# EAGLE design MLX90614-IR_V1.0 (EAGLE 9.6.2)
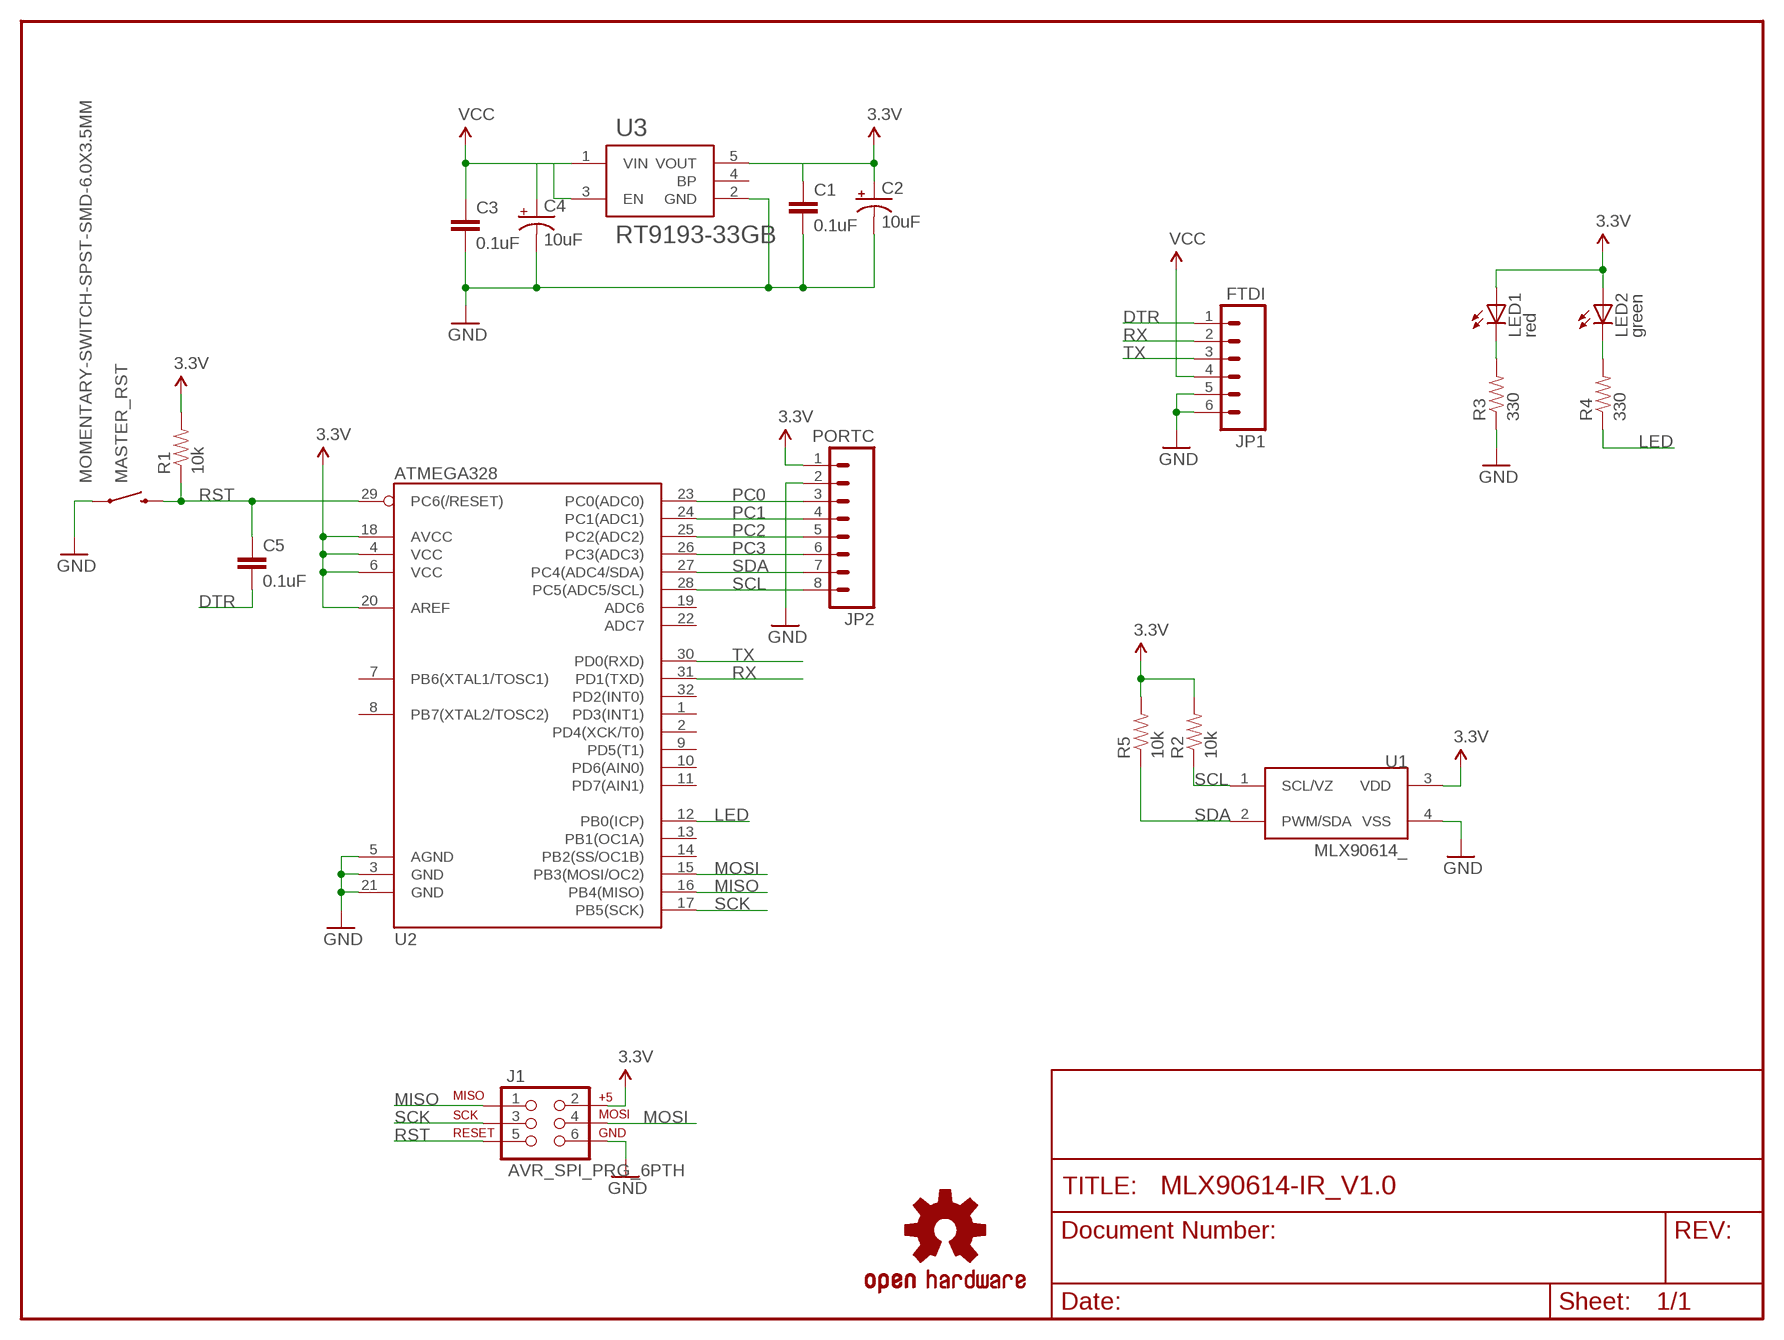
[diagram p0: schematic, sheet 1]

## Parts
C1  0.1uF  CAP0603-CAP  [0603-CAP]
C2  10uF  CAP_POL1206  [EIA3216]
C3  0.1uF  CAP0603-CAP  [0603-CAP]
C4  10uF  CAP_POL1206  [EIA3216]
C5  0.1uF  CAP0603-CAP  [0603-CAP]
J1  AVR_SPI_PRG_6PTH  [2X3]
JP1  FTDI  M06SIP  [1X06]
JP2  PORTC  M08  [1X08]
LED1  red  LED0603  [LED-0603]
LED2  green  LED0603  [LED-0603]
MASTER_RST  MOMENTARY-SWITCH-SPST-SMD-6.0X3.5MM  [TACTILE_SWITCH_SMD_6.0X3.5MM]
R1  10k  RESISTOR0603-RES  [0603-RES]
R2  10k  RESISTOR0603-RES  [0603-RES]
R3  330  RESISTOR0603-RES  [0603-RES]
R4  330  RESISTOR0603-RES  [0603-RES]
R5  10k  RESISTOR0603-RES  [0603-RES]
U1  MLX90614_  [TO-39]
U2  ATMEGA328  ATMEGA168  [TQFP32-08]
U3  RT9193-33GB  [SOT94P279X129-5N]
U$1  OSHW-LOGOS  [OSHW-LOGO-S]

## Nets
3.3V: C1.1 C2.A(+) J1.2 JP2.1 LED1.A LED2.A R1.2 R2.2 R5.2 U1.3(VDD) U2.4(VCC) U2.6(VCC) U2.18(AVCC) U2.20(AREF) U3.5(VOUT)
DTR: C5.2 JP1.1
GND: C1.2 C2.C(-) C3.2 C4.C(-) J1.6 JP1.5 JP1.6 JP2.2 MASTER_RST.1 R3.1 U1.4(VSS) U2.3(GND) U2.5(AGND) U2.21(GND) U3.2(GND)
LED: R4.1 U2.12(PB0(ICP))
MISO: J1.1 U2.16(PB4(MISO))
MOSI: J1.4 U2.15(PB3(MOSI/OC2))
N$2: LED1.C R3.2
N$3: LED2.C R4.2
PC0: JP2.3 U2.23(PC0(ADC0))
PC1: JP2.4 U2.24(PC1(ADC1))
PC2: JP2.5 U2.25(PC2(ADC2))
PC3: JP2.6 U2.26(PC3(ADC3))
RST: C5.1 J1.5 MASTER_RST.2 R1.1 U2.29(PC6(/RESET))
RX: JP1.2 U2.31(PD1(TXD))
SCK: J1.3 U2.17(PB5(SCK))
SCL: JP2.8 R2.1 U1.1(SCL/VZ) U2.28(PC5(ADC5/SCL))
SDA: JP2.7 R5.1 U1.2(PWM/SDA) U2.27(PC4(ADC4/SDA))
TX: JP1.3 U2.30(PD0(RXD))
VCC: C3.1 C4.A(+) JP1.4 U3.1(VIN) U3.3(EN)
Unconnected: U2.1(PD3(INT1)) U2.2(PD4(XCK/T0)) U2.7(PB6(XTAL1/TOSC1)) U2.8(PB7(XTAL2/TOSC2)) U2.9(PD5(T1)) U2.10(PD6(AIN0)) U2.11(PD7(AIN1)) U2.13(PB1(OC1A)) U2.14(PB2(SS/OC1B)) U2.19(ADC6) U2.22(ADC7) U2.32(PD2(INT0)) U3.4(BP)

## Library data of the parts
C1 C3 C5 = SparkFun:CAP: Capacitor Standard 0603 ceramic capacitor, and 0.1" leaded capacitor.
C2 C4 = SparkFun:CAP_POL: Capacitor Polarized These are standard SMD and PTH capacitors. Normally 10uF, 47uF, and 100uF in electrolytic and tantalum varieties. Always verify the external diameter of the through hole cap, it varies with capacity, voltage, and manufacturer. The EIA devices should be standard.
J1 = SparkFun:AVR_SPI_PRG_6: AVR ISP 6 Pin This is the reduced ISP connector for AVR programming. Common on Arduino. This footprint will take up less PCB space and can be used with a 10-pin to 6-pin adapter such as SKU: BOB-08508
JP1 = SparkFun:M06: Header 6 Standard 6-pin 0.1" header. Use with straight break away headers (SKU : PRT-00116), right angle break away headers (PRT-00553), swiss pins (PRT-00743), machine pins (PRT-00117), and female headers (PRT-00115). Molex polarized connector foot print use with SKU : PRT-08094 with associated crimp pins and housings. NOTES ON THE VARIANTS LOCK and LOCK_LONGPADS... This footprint was designed to help hold the alignment of a through-hole component (i.e. 6-pin header) while soldering it into place. You may notice that each hole has been shifted either up or down by 0.005 of an inch from it's more standard position (which is a perfectly straight line). This slight alteration caused the pins (the squares in the middle) to touch the edges of the holes. Because they are alternating, it causes a "brace" to hold the component in place. 0.005 has proven to be the perfect amount of "off-center" position when using our standard breakaway headers. Although looks a little odd when you look at the bare footprint, once you have a header in there, the alteration is very hard to notice. Also, if you push a header all the way into place, it is covered up entirely on the bottom side. This idea of altering the position of holes to aid alignment will be further integrated into the Sparkfun Library for other footprints. It can help hold any component with 3 or more connection pins.
JP2 = SparkFun:M08: Header 8 Standard 8-pin 0.1" header. Use with straight break away headers (SKU : PRT-00116), right angle break away headers (PRT-00553), swiss pins (PRT-00743), machine pins (PRT-00117), and female headers (PRT-00115).
LED1 LED2 = SparkFun:LED: LEDs Standard schematic elements and footprints for 5mm, 3mm, 1206, and 0603 sized LEDs. 5mm - Spark Fun Electronics SKU : COM-00529 (and others)
MASTER_RST = SparkFun-Switches:MOMENTARY-SWITCH-SPST: Momentary Switch (Pushbutton) - SPST Normally-open (NO) SPST momentary switches (buttons, pushbuttons). Variants PTH-12MM - 12mm square, through-hole Momentary Pushbutton Switch - 12mm Square <https://www.sparkfun.com/products/9190> (COM-09190) PTH-6.0MM, PTH-6.0MM-KIT - 6.0mm square, through-hole Mini Pushbutton Switch <https://www.sparkfun.com/products/97> (COM-00097) KIT package intended for soldering kit's - only one side of pads' copper is exposed. PTH-RIGHT-ANGLE-KIT - Right-angle, through-hole Right Angle Tactile Button <https://www.sparkfun.com/products/10791> - Used on SparkFun BigTime Watch Kit <https://www.sparkfun.com/products/11734> SMD-12MM - 12mm square, surface-mount Tactile Button - SMD (12mm) <https://www.sparkfun.com/products/12993> (COM-12993) Used on SparkFun PicoBoard <https://www.sparkfun.com/products/11888> SMD-4.5MM - 4.5mm Square Trackball Switch Used on SparkFun Blackberry Trackballer Breakout <https://www.sparkfun.com/products/13169> SMD-4.6MMX2.8MM - 4.60mm x 2.80mm, surface mount Used on SparkFun SAMD21 Mini Breakout <https://www.sparkfun.com/products/13664> SMD-5.2MM, SMD-5.2-REDUNDANT - 5.2mm square, surface-mount Mini Pushbutton Switch - SMD <https://www.sparkfun.com/products/8720> (COM-08720) Used on Arduino Pro Mini <https://www.sparkfun.com/products/11114> REDUNDANT package connects both switch circuits together SMD-6.0X3.5MM - 6.0 x 3.5mm, surface mount Momentary Reset Switch SMD <https://www.sparkfun.com/products/8229> (COM-08229) SMD-6.2MM-TALL - 6.2mm square, surface mount Tactile Button - SMD (6mm) <https://www.sparkfun.com/products/12992> Used on SparkFun Digital Sandbox <https://www.sparkfun.com/products/12651> SMD-RIGHT-ANGLE - Right-angle, surface mount Used on SparkFun Block for Intel® Edison - Arduino <https://www.sparkfun.com/products/13036>; OC_FARNELL: unknown; PROD_ID: SWCH-00815; SF_SKU: COM-08229
R1-R5 = SparkFun:RESISTOR: Resistor Basic schematic elements and footprints for 0603, 1206, and PTH 1/10th watt (small) resistors.
U1 = SparkFun:MLX90614: Melexis IR Thermometer
U2 = SparkFun:ATMEGA168
U3 = RT9193-33GB:RT9193-33GB: RT9193 Series 300 mA 3.3 V Ultra-Low Noise Ultra-Fast CMOS LDO Regulator-SC-70-5 Buy Part <https://snapeda.com/parts/RT9193-33GB/Richtek%20USA/view-part/?ref=eda>; AVAILABILITY: Warning; DESCRIPTION: Linear Voltage Regulator IC 1 Output 300mA SOT-23-5; DIGIKEY-PURCHASE-URL: https://snapeda.com/shop?store=DigiKey&id=55570; MF: Richtek USA; MP: RT9193-33GB; PACKAGE: SOT-23-5 Richtek; PRICE: None
U$1 = SparkFun:OSHW-LOGO: Open Source Hardware Logo This logo indicates the piece of hardware it is found on incorporates a OSHW license and/or adheres to the definition of open source hardware found here: http://freedomdefined.org/OSHW

## Net classes
0 default: width 0.254 mm, drill 0.584 mm, clearance 0.254 mm

## Board
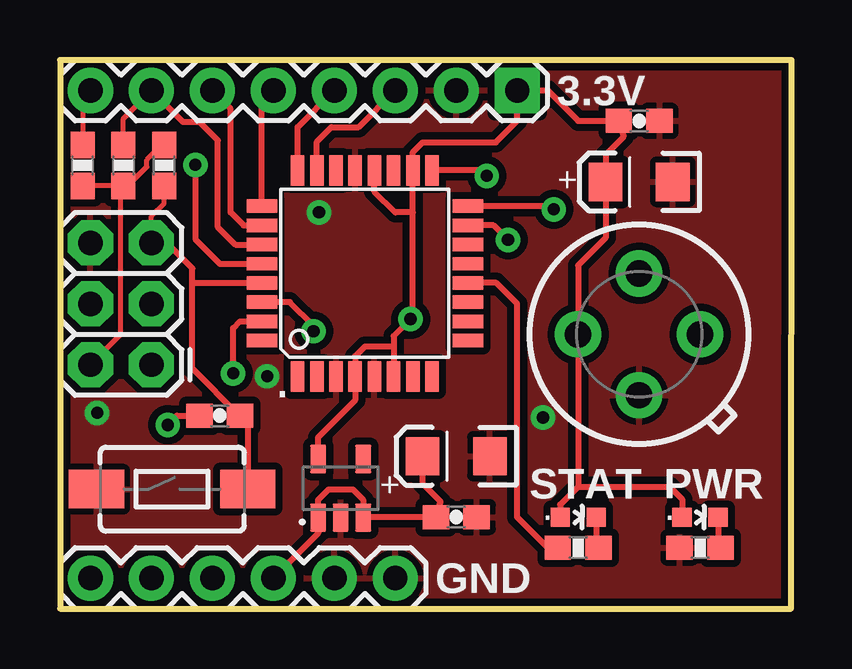
[diagram p1: board, top side]
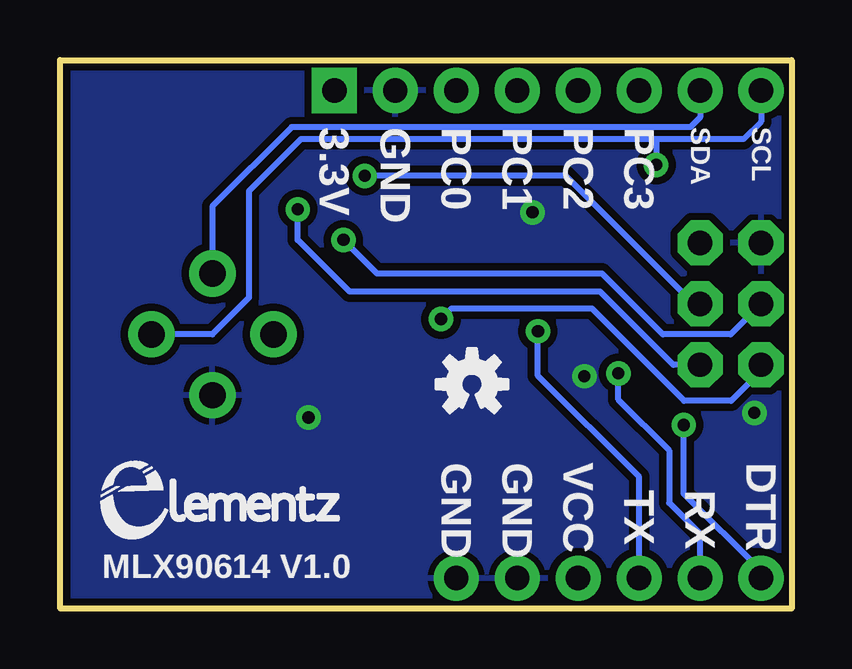
[diagram p2: board, bottom side, seen from below]

Size 30.48 x 22.86 mm. Coordinates in mm from the lower left corner, seen from the top.
Outline: 0,0 30.46,0 30.48,22.86 0,22.86 0,0
Copper layers (1*16): Top 0.035mm / dielectric 1.5mm / Bottom 0.035mm
Design rules "SparkFun": minimum track width 8mil, minimum drill 20mil, track to track 8mil, track to pad 8mil, pad to pad 8mil, via to via 8mil, smd to smd 8mil, copper to edge 8mil, drill to drill 8mil, minimum pad ring 12mil, minimum via ring 10mil, stop-mask expansion 4mil, vias tented up to drill 20mil, thermal gap 10mil

### Footprints (pad centres in the part's own frame; a part is rotated, then mirrored left to right if it is on the bottom)
0603-CAP = smd 1.1 x 1: 1 -0.85,0; 2 0.85,0
EIA3216 = smd 1.4 x 1.6: A 1.4,0; C -1.4,0
2X3 = drill 1.016 pad 1.88 octagon: 1 0,0; 2 0,2.54; 3 2.54,0; 4 2.54,2.54; 5 5.08,0; 6 5.08,2.54
1X06 = drill 1.016 pad 1.88: 1 0,0; 2 2.54,0; 3 5.08,0; 4 7.62,0; 5 10.16,0; 6 12.7,0
1X08 = drill 1.016 pad 1.88 square: 1 0,0 | drill 1.016 pad 1.88: 2 2.54,0; 3 5.08,0; 4 7.62,0; 5 10.16,0; 6 12.7,0; 7 15.24,0; 8 17.78,0
LED-0603 = smd 0.8 x 0.8: A 0,-0.75; C 0,0.75
TACTILE_SWITCH_SMD_6.0X3.5MM = smd 2.3 x 1.6: 1 -3.15,0; 2 3.15,0
0603-RES = smd 1.1 x 1: 1 -0.85,0; 2 0.85,0
TO-39 = drill 1.1 pad 1.93: 1 2.54,0; 2 0,2.54; 3 -2.54,0; 4 0,-2.54
TQFP32-08 = smd 1.27 x 0.559: 1 -4.293,2.8; 2 -4.293,2; 3 -4.293,1.2; 4 -4.293,0.4; 5 -4.293,-0.4; 6 -4.293,-1.2; 7 -4.293,-2; 8 -4.293,-2.8; 17 4.293,-2.8; 18 4.293,-2; 19 4.293,-1.2; 20 4.293,-0.4; 21 4.293,0.4; 22 4.293,1.2; 23 4.293,2; 24 4.293,2.8 | smd 0.559 x 1.27: 9 -2.8,-4.293; 10 -2,-4.293; 11 -1.2,-4.293; 12 -0.4,-4.293; 13 0.4,-4.293; 14 1.2,-4.293; 15 2,-4.293; 16 2.8,-4.293; 25 2.8,4.293; 26 2,4.293; 27 1.2,4.293; 28 0.4,4.293; 29 -0.4,4.293; 30 -1.2,4.293; 31 -2,4.293; 32 -2.8,4.293
SOT94P279X129-5N = smd 1.17 x 0.67: 1 -1.22,0.94; 2 -1.22,0; 3 -1.22,-0.94; 4 1.22,-0.94; 5 1.22,0.94

### Placement (x,y rotation side)
C1  24.13,20.32 0 top
C2  24.13,17.78 180 top
C3  16.51,3.81 0 top
C4  16.51,6.35 180 top
C5  6.65,8.04 180 top
J1  3.81,10.16 90 top
JP1  1.27,1.27 0 top
JP2  19.05,21.59 180 top
LED1  26.67,3.81 270 top
LED2  21.59,3.81 270 top
MASTER_RST  4.67,4.98 0 top
R1  4.34,18.47 90 top
R2  0.94,18.47 270 top
R3  26.67,2.54 0 top
R4  21.59,2.54 0 top
R5  2.64,18.47 270 top
U1  24.13,11.43 0 top
U2  12.7,13.97 90 top
U3  11.69,5.01 90 top
U$1  13.31,9.35 0 bottom

### Tracks (layer width: path | path; a pad name or v marks a point on that pad's centre or on a via)
3.3V  (via drill 0.51)
  Top 0.203: J1.2 2.54,11.43 2.54,17.62 | R1.2 4.24,19.32 3.62,18.69 3.62,18.41 2.82,17.62 R5.2 2.54,17.62 | R2.2 0.96,17.64 2.52,17.64 2.54,17.62
  Top 0.254: LED2.A 20.84,4.33 21.59,5.08 | LED1.A 25.92,4.56 25.4,5.08 21.59,5.08 | 21.59,5.08 U1.3 21.59,14.31 22.73,15.45 C2.A 22.73,18.92 23.48,19.67 C1.1 21.59,20.32 20.32,21.59 JP2.1 19.05,20.32 18.16,19.43 15.11,19.43 14.7,19.02 U2.18 14.7,16.51 | U2.20 13.1,17.38 13.97,16.51 14.7,16.51 | 14.7,16.51 14.7,12.16 v14.61,12.07 13.9,11.36 13.9,10.92 | 13.9,10.92 U2.6 | 13.9,10.92 12.7,10.92 12.3,10.52 U2.4 12.3,8.68 10.75,7.14 U3.5
  Bottom 0.254: J1.2 1.27,9.91 2.52,8.66 4.47,8.66 8.31,12.5 14.17,12.5 v14.61,12.07
DTR  (via drill 0.51)
  Top 0.254: v4.49,7.66 4.88,8.04 C5.2
  Bottom 0.254: JP1.1 1.27,1.58 4.49,4.8 v4.49,7.66
GND  (via drill 0.51)
  other vias: 10.79,16.51 20.12,7.97 1.55,8.16 8.63,9.68
  pour Top (isolate 0.305): 0,22.86 0,0 30.48,0 30.48,22.86
  pour Bottom (isolate 0.305): 0,22.86 0,0 30.48,0 30.48,22.86
LED
  Top 0.254: R4.1 20.32,2.54 19.05,3.81 19.05,12.7 18.18,13.57 U2.12
MISO  (via drill 0.51)
  Top 0.254: U2.16 20.44,16.77 v20.57,16.64
  Bottom 0.254: J1.1 4.93,10.16 7.98,13.21 18.41,13.21 20.57,15.37 v20.57,16.64
MOSI  (via drill 0.51)
  Top 0.254: U2.15 18.07,15.97 v18.67,15.37
  Bottom 0.254: v18.67,15.37 17.27,13.97 7.9,13.97 5.36,11.43 2.54,11.43 J1.4
N$2
  Top 0.254: LED1.C 27.42,2.64 R3.2
N$3
  Top 0.254: LED2.C 22.34,2.64 R4.2
PC0
  Top 0.254: U2.23 10.7,19.46 11.3,20.07 12.45,20.07 JP2.3
PC1
  Top 0.254: U2.24 9.9,20.06 JP2.4
PC2
  Top 0.254: U2.25 8.41,21.11 JP2.5
PC3
  Top 0.254: U2.26 7.65,15.97 7.11,16.51 7.11,20.83 JP2.6
RST
  Top 0.203: J1.5 3.81,16.35 4.34,16.88 R1.1
  Top 0.254: J1.5 4.45,15.24 5.51,14.17 5.51,13.59 | U2.29 5.53,13.57 5.51,13.59 | 5.51,13.59 5.51,10.01 7.48,8.04 C5.1 7.82,7.72 MASTER_RST.2
RX  (via drill 0.51)
  Top 0.254: U2.31 7.5,11.97 7.21,11.68 v7.21,9.8
  Bottom 0.254: JP1.2 3.81,3.12 5.1,4.41 5.1,6.6 7.21,8.71 v7.21,9.8
SCK  (via drill 0.51)
  Top 0.254: U2.17 17.55,18.26 v17.78,18.03
  Bottom 0.254: v17.78,18.03 9.4,18.03 4.06,12.7 J1.3
SCL  (via drill 0.51)
  Top 0.203: R2.1 0.94,21.26 JP2.8
  Top 0.254: U2.28 6.66,14.37 5.64,15.39 v5.64,18.49
  Bottom 0.203: 5.54,19.56 5.59,19.56
  Bottom 0.254: U1.1 24.13,11.43 22.61,12.95 22.61,17.4 20.45,19.56 5.59,19.56 | JP2.8 1.27,20.29 2.01,19.56 5.54,19.56 5.64,19.56 v5.64,18.49
SDA
  Top 0.203: R5.1 2.64,20.42 JP2.7
  Top 0.254: U2.27 7.31,15.17 6.58,15.9 6.58,19.51 5.82,20.27 5.13,20.27 JP2.7
  Bottom 0.254: U1.2 24.13,16.76 20.83,20.07 4.22,20.07 3.81,20.47 JP2.7
TX  (via drill 0.51)
  Top 0.254: U2.30 9.58,12.77 10.57,11.79 v10.57,11.56
  Bottom 0.254: JP1.3 6.35,5.49 10.57,9.7 v10.57,11.56
VCC
  Top 0.254: C4.A 15.11,5.21 15.86,4.46 C3.1 12.65,3.81 U3.3 12.63,4.54 12.2,4.97 11.2,4.97 10.75,4.53 U3.1 10.75,3.13 JP1.4

### Text on the board
tPlace: 3.3V | + | . | + | STAT | PWR | . | . | GND
bPlace: SCL | SDA | PC3 | PC2 | PC1 | PC0 | GND | 3.3V | DTR | VCC | GND | GND | RX | TX | MLX90614 V1.0
tCream: RST